# EAGLE design loochi-0.4 (EAGLE 6.2)
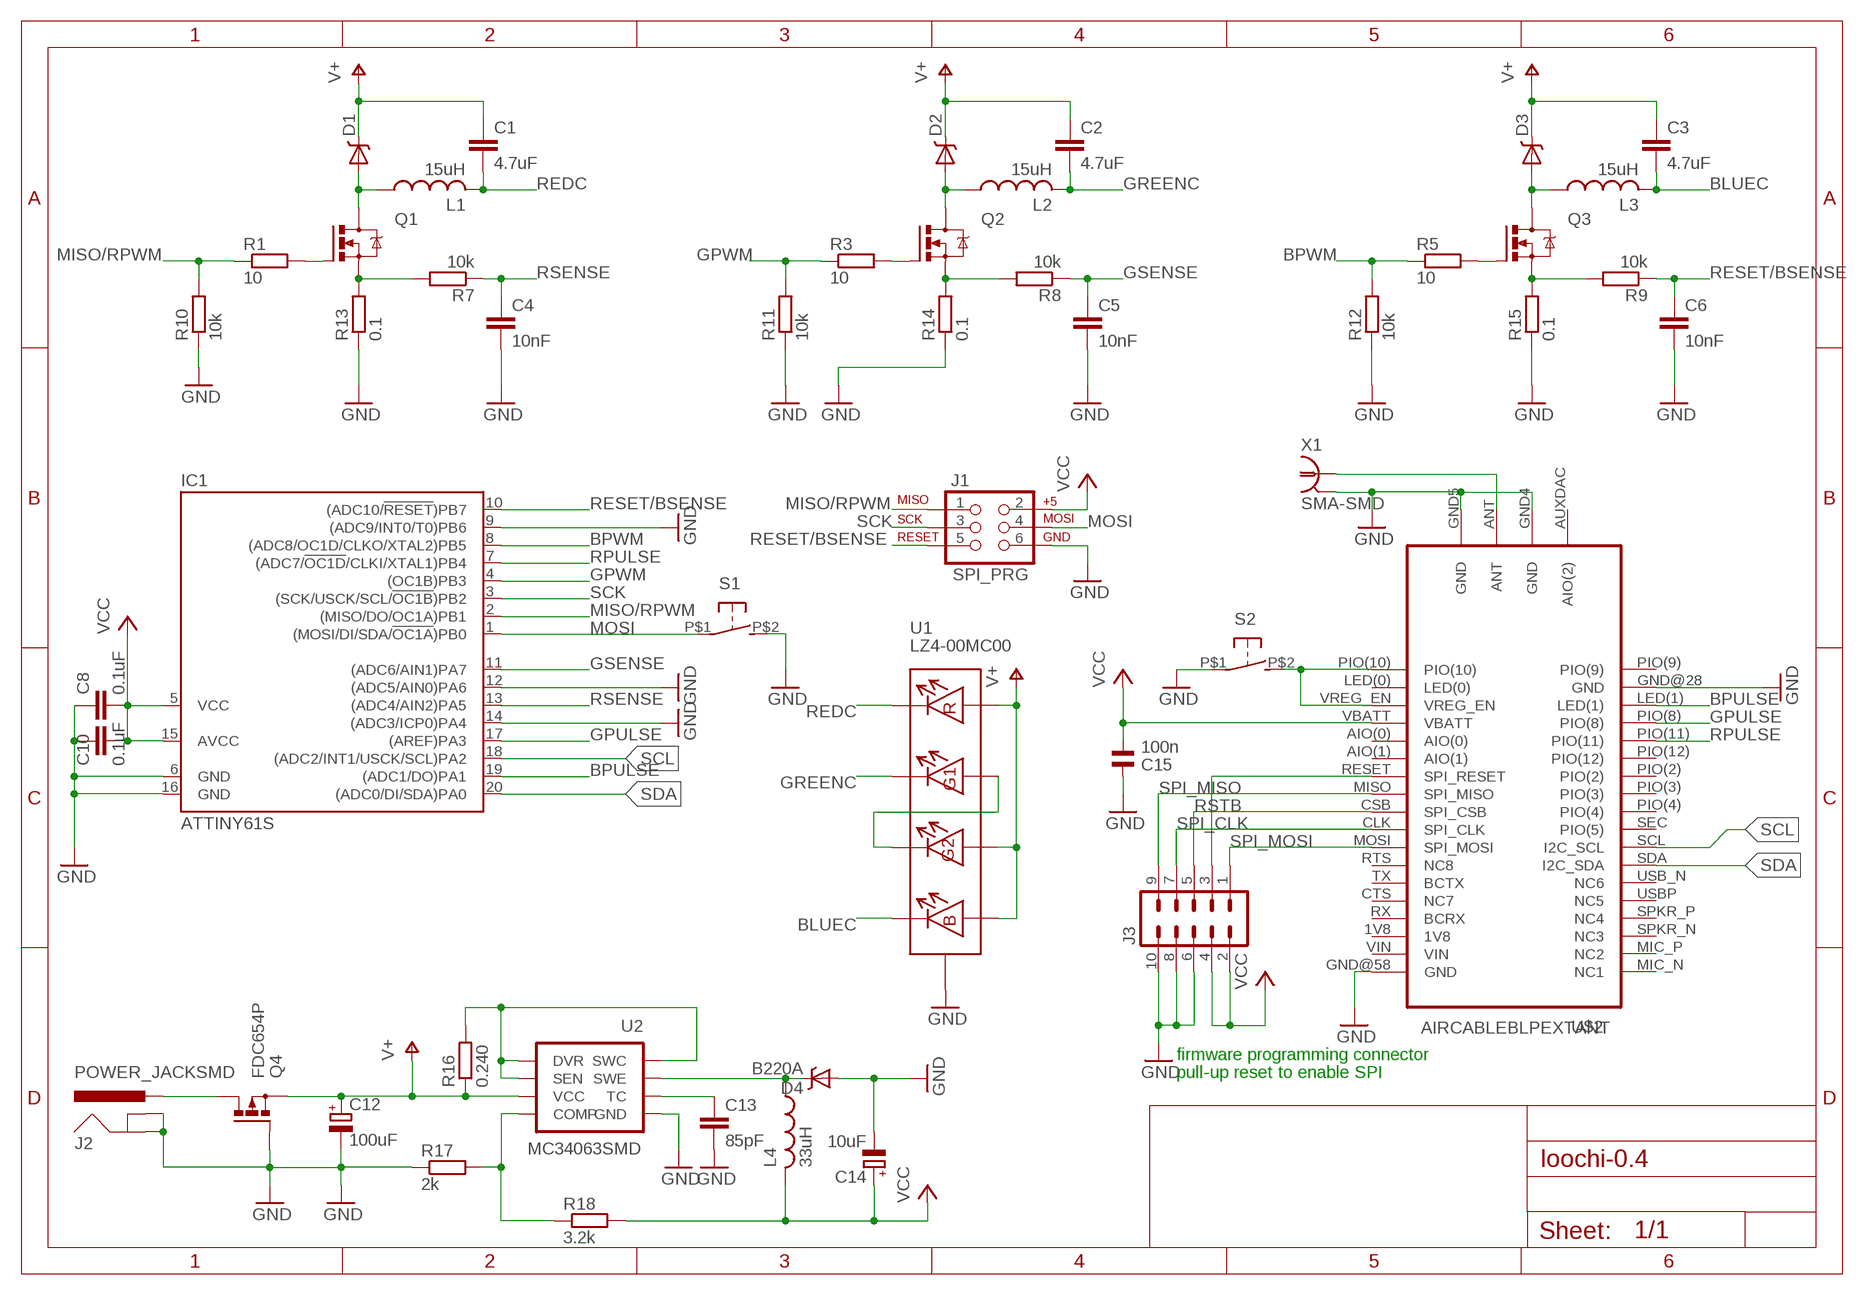
[diagram p0: schematic, sheet 1]

## Parts
C1  4.7uF  C-EUC0805  [C0805]
C2  4.7uF  C-EUC0805  [C0805]
C3  4.7uF  C-EUC0805  [C0805]
C4  10nF  C-EUC0805  [C0805]
C5  10nF  C-EUC0805  [C0805]
C6  10nF  C-EUC0805  [C0805]
C8  0.1uF  C-EUC0805  [C0805]
C10  0.1uF  C-EUC0805  [C0805]
C12  100uF  CPOL-EUD  [PANASONIC_D]
C13  85pF  C-EUC0805  [C0805]
C14  10uF  CPOL-EUUD-4X5,8  [UD-4X5,8_NICHICON]
C15  100n  C_0805  [C0805]
D1  PMEG4010CEH  DIODE-SCHOTTKY  [SOD123F]
D2  PMEG4010CEH  DIODE-SCHOTTKY  [SOD123F]
D3  PMEG4010CEH  DIODE-SCHOTTKY  [SOD123F]
D4  B220A  DIODE-SCHOTTKYBIGPAD  [SMA-DIODE-BIG]
IC1  ATTINY61S  [SO20L]
J1  SPI_PRG  AVR_SPI_PRG_6NS  [2X3-NS]
J2  POWER_JACKSMD  [POWER_JACK_SMD]
J3  MA05-2  [MA05-2]
L1  15uH  L-USBOURNS-6045  [BOURNS-6045]
L2  15uH  L-USBOURNS-6045  [BOURNS-6045]
L3  15uH  L-USBOURNS-6045  [BOURNS-6045]
L4  33uH  L-USBOURNS-6045  [BOURNS-6045]
Q1  PMN25ENSOT457  [SOT457]
Q2  PMN25ENSOT457  [SOT457]
Q3  PMN25ENSOT457  [SOT457]
Q4  FDC654P  [SUPERSOT6]
R1  10  R-EU_R0805  [R0805]
R3  10  R-EU_R0805  [R0805]
R5  10  R-EU_R0805  [R0805]
R7  10k  R-EU_R0805  [R0805]
R8  10k  R-EU_R0805  [R0805]
R9  10k  R-EU_R0805  [R0805]
R10  10k  R-EU_R0805  [R0805]
R11  10k  R-EU_R0805  [R0805]
R12  10k  R-EU_R0805  [R0805]
R13  0.1  R-EU_R0805  [R0805]
R14  0.1  R-EU_R0805  [R0805]
R15  0.1  R-EU_R0805  [R0805]
R16  0.240  R-EU_R0805  [R0805]
R17  2k  R-EU_R0805  [R0805]
R18  3.2k  R-EU_R0805  [R0805]
S1  ALPS-SKRK39X29  [ALPS-SKRK-39X29]
S2  ALPS-SKRK39X29  [ALPS-SKRK-39X29]
U1  LZ4-00MC00  [LZ4-00MC00]
U2  MC34063SMD  [SO08]
U$2  AIRCABLEBLPEXTANT  [AIRCABLEBLP]
X1  SMA-SMD  [SMA-SMD]

## Nets
BLUEC: C3.2 L3.P$2 U1.P$8
BPULSE: IC1.19((ADC1/DO)PA1) U$2.LED(1)
BPWM: IC1.8((ADC8/OC1D/CLKO/XTAL2)PB5) R5.1 R12.2
GND: C4.2 C5.2 C6.2 C8.1 C10.1 C12.- C13.2 C14.- C15.1 D4.A IC1.6(GND) IC1.9((ADC9/INT0/T0)PB6) IC1.12((ADC5/AIN0)PA6) IC1.14((ADC3/ICP0)PA4) IC1.16(GND) J1.6 J2.GND(GNDBREAK) J2.P$4(GND) J3.6 J3.8 J3.10 Q4.P$3(G) R10.1 R11.1 R12.1 R13.1 R14.1 R15.1 R17.1 S1.P$2(S) S2.P$1(P) U1.THERMAL U1.THERMAL-VIA2(THERMAL) U1.THERMAL-VIA(THERMAL) U2.4(GND) U$2.GND4(GND) U$2.GND5(GND) U$2.GND@28(GND) U$2.GND@58(GND) X1.2@1(GND)
GPULSE: IC1.17((AREF)PA3) U$2.PIO(8)
GPWM: IC1.4((OC1B)PB3) R3.1 R11.2
GREENC: C2.2 L2.P$2 U1.P$6
GSENSE: C5.1 IC1.11((ADC6/AIN1)PA7) R8.1
MISO/RPWM: IC1.2((MISO/DO/OC1A)PB1) J1.1 R1.1 R10.2
MOSI: IC1.1((MOSI/DI/SDA/!OC1A!)PB0) J1.4 S1.P$1(P)
N$1: U1.P$1 U1.P$5
N$2: U$2.ANT X1.1
N$3: Q3.P$3(G) R5.2
N$4: Q2.P$3(G) R3.2
N$5: Q1.P$3(G) R1.2
N$6: S2.P$2(S) U$2.PIO(10) U$2.VREG_EN
N$7: Q1.P$4(S) R7.2 R13.2
N$8: D1.P$A(A) L1.P$1 Q1.P$1(D) Q1.P$2(D) Q1.P$5(D) Q1.P$6(D)
N$10: J2.VIN0(PWR) J2.VIN1(PWR) Q4.P$1(D) Q4.P$2(D) Q4.P$5(D) Q4.P$6(D)
N$14: D2.P$A(A) L2.P$1 Q2.P$1(D) Q2.P$2(D) Q2.P$5(D) Q2.P$6(D)
N$15: J3.3 U$2.RESET(SPI_RESET)
N$16: R16.2 U2.1(SWC) U2.7(SEN) U2.8(DVR)
N$17: Q2.P$4(S) R8.2 R14.2
N$18: C13.1 U2.3(TC)
N$23: D3.P$A(A) L3.P$1 Q3.P$1(D) Q3.P$2(D) Q3.P$5(D) Q3.P$6(D)
N$24: D4.C L4.P$1 U2.2(SWE)
N$25: Q3.P$4(S) R9.2 R15.2
N$26: R17.2 R18.1 U2.5(COMP)
REDC: C1.2 L1.P$2 U1.P$4
RESET/BSENSE: C6.1 IC1.10((ADC10/!RESET!)PB7) J1.5 R9.1
RPULSE: IC1.7((ADC7/!OC1D!/CLKI/XTAL1)PB4) U$2.PIO(11)
RSENSE: C4.1 IC1.13((ADC4/AIN2)PA5) R7.1
RSTB: J3.5 U$2.CSB(SPI_CSB)
SCK: IC1.3((SCK/USCK/SCL/!OC1B!)PB2) J1.3
SCL: IC1.18((ADC2/INT1/USCK/SCL)PA2) U$2.SCL(I2C_SCL)
SDA: IC1.20((ADC0/DI/SDA)PA0) U$2.SDA(I2C_SDA)
SPI_CLK: J3.7 U$2.CLK(SPI_CLK)
SPI_MISO: J3.9 U$2.MISO(SPI_MISO)
SPI_MOSI: J3.1 U$2.MOSI(SPI_MOSI)
V+: C1.1 C2.1 C3.1 C12.+ D1.P$C(C) D2.P$C(C) D3.P$C(C) Q4.P$4(S) R16.1 U1.P$2 U1.P$3 U1.P$7 U2.6(VCC)
VCC: C8.2 C10.2 C14.+ C15.2 IC1.5(VCC) IC1.15(AVCC) J1.2 J3.2 J3.4 L4.P$2 R18.2 U$2.VBATT
Unconnected: U$2.1V8 U$2.AIO(0) U$2.AIO(1) U$2.AUXDAC(AIO(2)) U$2.CTS(NC7) U$2.LED(0) U$2.MIC_N(NC1) U$2.MIC_P(NC2) U$2.PIO(2) U$2.PIO(3) U$2.PIO(4) U$2.PIO(9) U$2.PIO(12) U$2.RTS(NC8) U$2.RX(BCRX) U$2.SEC(PIO(5)) U$2.SPKR_N(NC3) U$2.SPKR_P(NC4) U$2.TX(BCTX) U$2.USB_N(NC6) U$2.USBP(NC5) U$2.VIN

## Notes on the sheet
- firmware programming connector
- pull-up reset to enable SPI

## Power pins joined to a net without a drawn wire
GND: X1.2@2(GND) X1.2@3(GND) X1.2@4(GND) X1.2@5(GND) X1.2@6(GND)

## Library data of the parts
C1-C6 C8 C10 C13 = rcl:C-EU: CAPACITOR, European symbol
C12 C14 = rcl:CPOL-EU: POLARIZED CAPACITOR, European symbol
C15 = rc-master-smd:C_: NON-POLARIZED CAP; PARTNO: *
D1-D4 = diode-schottky:DIODE-SCHOTTKY
IC1 = attinyx61:ATTINY*61: AtTinyX61; MPN: ATTINY261-20SU; OC_FARNELL: 1455147; OC_NEWARK: 58M3783
J1 = SparkFun:AVR_SPI_PRG_6: AVR ISP 6 Pin This is the reduced ISP connector for AVR programming. Common on Arduino. This footprint will take up less PCB space and can be used with a 10-pin to 6-pin adapter such as SKU: BOB-08508
J2 = SparkFun:POWER_JACK: Power Jack This is the standard 5.5mm barrel jack for power. The PTH is the most common, proven, reliable, footprint. All others are experimental. The Slot footprint only works if the mill layer is transmitted to the PCB fab house so be warned. Spark Fun Electronics SKU : PRT-00119. Mating wall wart : TOL-00298 (and others)
J3 = con-lstb:MA05-2: PIN HEADER
L1-L4 = inductors:L-US: INDUCTOR, American symbol
Q1-Q3 = mosfet:PMN25EN: N-CHANNEL MOS FET
Q4 = mosfet:FDC654P: FDC654P
R1 R3 R5 R7-R18 = rcl:R-EU_: RESISTOR, European symbol
S1 S2 = buttons:ALPS-SKRK: OMRON SWITCH
U1 = ledengin:LZ4-00MC00
U2 = SparkFun:MC34063
U$2 = aircable:AIRCABLEBLP
X1 = con-coax:SMA-SMD: SMA 50 Ohm Straight Jack Receptacle - Surface Mount www.johnsoncomponents.com Source: http://catalog.digikey.com .. 142-0711-201, 205, 202, 206.pdf; OC_FARNELL: unknown; OC_NEWARK: unknown

## Board
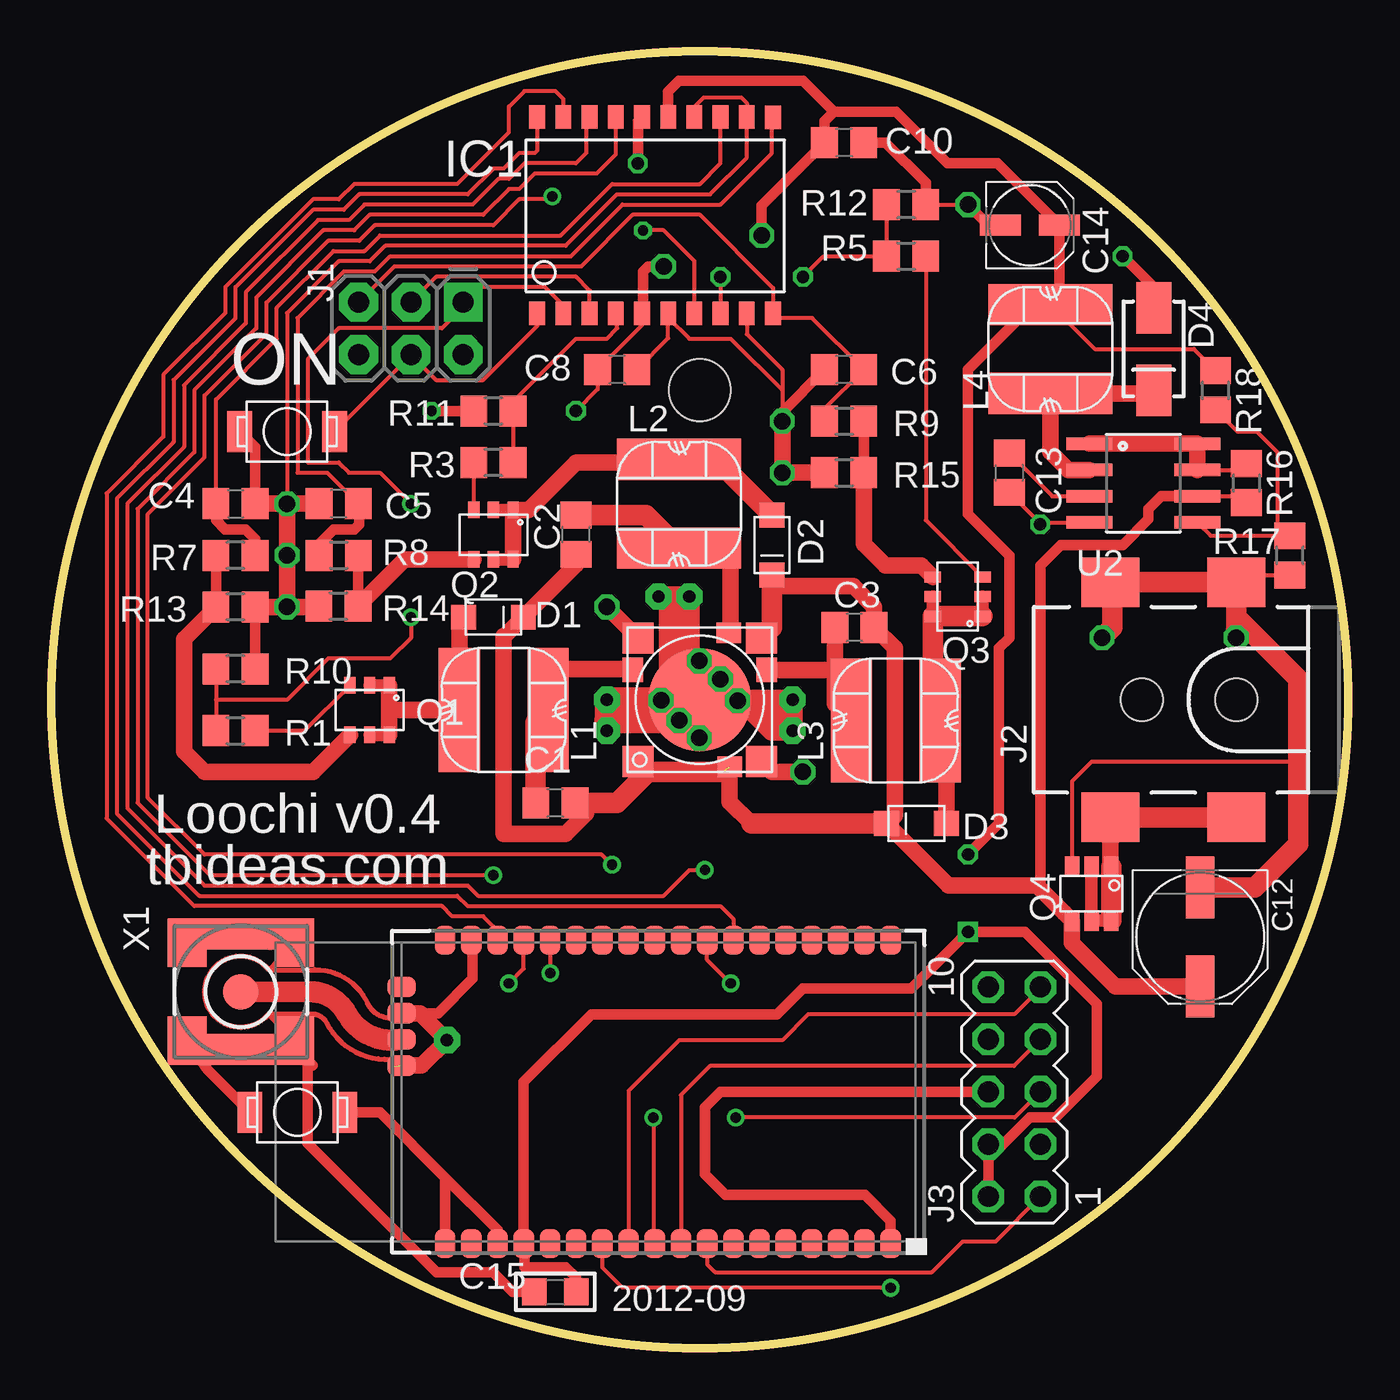
[diagram p1: board, top side]
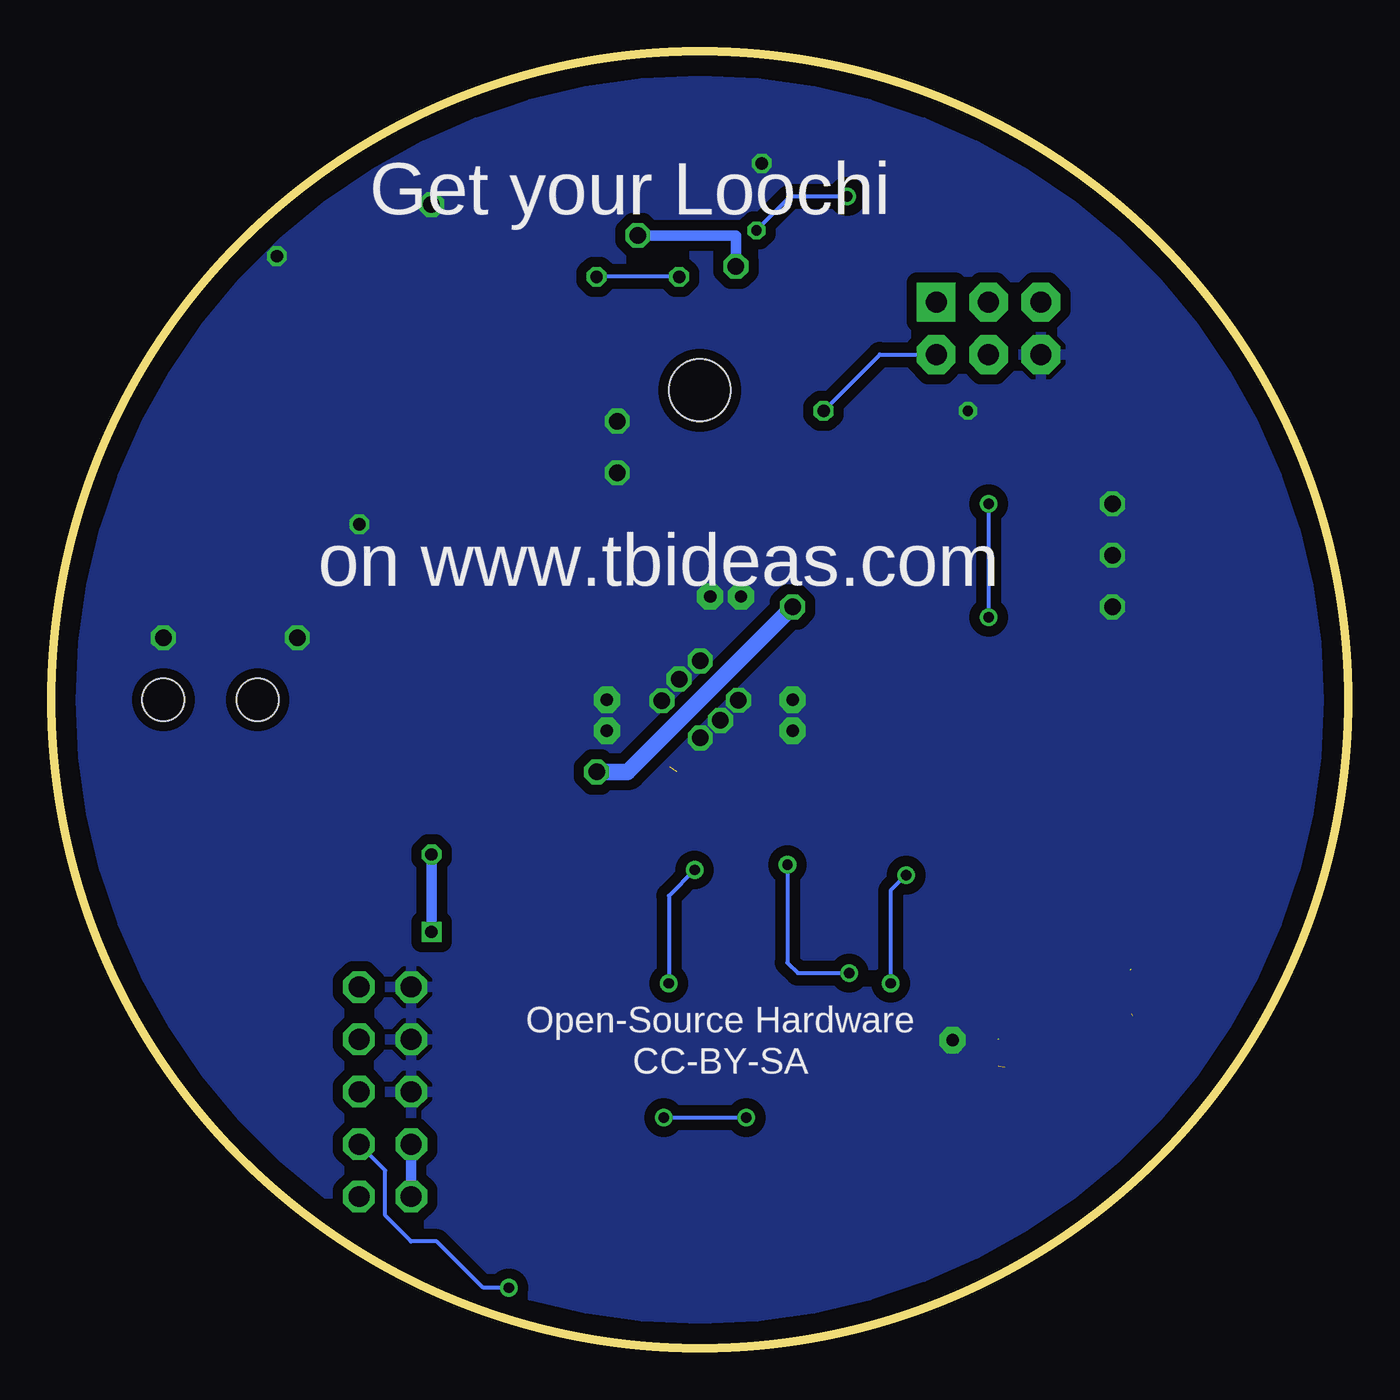
[diagram p2: board, bottom side, seen from below]

Size 62.83 x 62.83 mm. Coordinates in mm from the lower left corner, seen from the top.
Outline: circle at 31.42,31.42 radius 31.42
Copper layers (1*16): Top 0.0356mm / dielectric 1.5011mm / Bottom 0.0356mm
Design rules: minimum track width 6mil, minimum drill 13mil, track to track 6mil, track to pad 6mil, pad to pad 6mil, via to via 6mil, smd to smd 6mil, copper to edge 15mil, drill to drill 6mil, minimum pad ring 7mil, minimum via ring 7mil, stop-mask expansion 4mil, vias tented up to drill 0mil, thermal gap 10mil
Holes 3 mm at 31.42,46.42

### Footprints (pad centres in the part's own frame; a part is rotated, then mirrored left to right if it is on the bottom)
C0805 = smd 1.3 x 1.5: 1 -0.95,0; 2 0.95,0
PANASONIC_D = smd 3 x 1.4: + 2.4,0; - -2.4,0
UD-4X5,8_NICHICON = smd 2 x 1: + 1.425,0; - -1.425,0
C0805' = smd 1.2 x 1.3: 1 -1.016,0; 2 1.016,0
SOD123F = smd 1.2 x 1.2: P$A -1.45,0; P$C 1.45,0
SMA-DIODE-BIG = smd 2.5 x 1.7: A -2,0; C 2,0
SO20L = smd 0.762 x 1.143: 1 -5.08,-5.131; 2 -3.81,-5.131; 3 -2.54,-5.131; 4 -1.27,-5.131; 5 0,-5.131; 6 1.27,-5.131; 7 2.54,-5.131; 8 3.81,-5.131; 9 5.08,-5.131; 10 6.35,-5.131; 11 6.35,4.369; 12 5.08,4.394; 13 3.81,4.394; 14 2.54,4.394; 15 1.27,4.394; 16 0,4.394; 17 -1.27,4.394; 18 -2.54,4.394; 19 -3.81,4.394; 20 -5.08,4.394
2X3-NS = drill 1.016 pad 1.88 square: 1 -2.54,-1.27 | drill 1.016 pad 1.88 octagon: 2 -2.54,1.27; 3 0,-1.27; 4 0,1.27; 5 2.54,-1.27; 6 2.54,1.27
POWER_JACK_SMD = smd 2.8 x 2.4: GND 0,-5.7; P$4 6.1,-5.7; VIN0 0,5.7; VIN1 6.1,5.7 | hole 2.032: 0,0; 4.572,0
MA05-2 = drill 1.016 octagon: 1 -5.08,-1.27; 2 -5.08,1.27; 3 -2.54,-1.27; 4 -2.54,1.27; 5 0,-1.27; 6 0,1.27; 7 2.54,-1.27; 8 2.54,1.27; 9 5.08,-1.27; 10 5.08,1.27
BOURNS-6045 = smd 2 x 6: P$1 -2.15,0; P$2 2.15,0
SOT457 = smd 0.8 x 0.55: P$1 -1.2,0.95; P$2 -1.2,0; P$3 -1.2,-0.95; P$4 1.2,-0.95; P$5 1.2,0; P$6 1.2,0.95
SUPERSOT6 = smd 0.7 x 1: P$1 -0.95,-1.3; P$2 0,-1.3; P$3 0.95,-1.3; P$4 0.95,1.3; P$5 0,1.3; P$6 -0.95,1.3
R0805 = smd 1.3 x 1.5: 1 -0.95,0; 2 0.95,0
ALPS-SKRK-39X29 = smd 1.2 x 2: P$1 -2.3,0; P$2 2.3,0
LZ4-00MC00 = smd 1.5 x 1.5: P$1 -3,3; P$3 3,3; P$5 3,-3; P$7 -3,-3 | smd 1.2 x 1: P$2 -1.45,3.25; P$6 -1.4,-3.25 | smd 1 x 1.2: P$4 3.25,-1.45; P$8 -3.25,-1.45 | smd 5 x 5: THERMAL 0,0 | drill 0.8 octagon: THERMAL-VIA -1,-1; THERMAL-VIA2 1,1
SO08 = smd 0.61 x 2.21: 1 -1.905,-2.616; 2 -0.635,-2.616; 3 0.635,-2.616; 4 1.905,-2.616; 5 1.905,2.616; 6 0.635,2.616; 7 -0.635,2.616; 8 -1.905,2.616
AIRCABLEBLP = smd 1 x 1.4: 1V8 -8.71,7.35; AIO(0) 5.26,7.35; AIO(1) 3.99,7.35; CLK -1.09,7.35; CSB 0.18,7.35; CTS -3.63,7.35; GND@28 9.07,-7.35; GND@58 -11.25,7.35; LED(0) 9.07,7.35; LED(1) 7.8,-7.35; MIC_N -9.98,-7.35; MIC_P -11.25,-7.35; MISO 1.45,7.35; MOSI -2.36,7.35; PIO(2) 2.72,-7.35; PIO(3) 1.45,-7.35; PIO(4) 0.18,-7.35; PIO(8) 6.53,-7.35; PIO(9) 10.34,-7.35; PIO(10) 10.34,7.35; PIO(11) 5.26,-7.35; PIO(12) 3.99,-7.35; RESET 2.72,7.35; RTS -6.17,7.35; RX -7.44,7.35; SCL -2.36,-7.35; SDA -3.63,-7.35; SEC -1.09,-7.35; SPKR_N -7.44,-7.35; SPKR_P -8.71,-7.35; TX -4.9,7.35; USB_N -4.9,-7.35; USBP -6.17,-7.35; VBATT 6.53,7.35; VIN -9.98,7.35; VREG_EN 7.8,7.35 | smd 1.4 x 1: ANT 12.45,-2.54; AUXDAC 12.45,-5.08; GND4 12.45,-1.27; GND5 12.45,-3.81
SMA-SMD = smd 1.73 x 1.73: 1 0,0 | smd 2.35 x 1.9: 2@1 -2.375,2.6; 2@2 -2.375,-2.6; 2@3 2.375,-2.6; 2@4 2.375,2.6 | smd 1.5 x 3.4: 2@5 -2.8,0; 2@6 2.8,0

### Placement (x,y rotation side)
C1  24.42,26.42 180 top
C2  25.42,39.42 90 top
C3  38.92,34.92 180 top
C4  8.92,40.92 0 top
C5  13.92,40.92 180 top
C6  38.42,47.42 180 top
C8  27.42,47.42 180 top
C10  38.42,58.42 180 top
C12  55.67,19.92 270 top
C13  46.42,42.42 270 top
C14  47.42,54.42 0 top
C15  100n  [C0805']  24.42,2.72 0 top
D1  21.42,35.42 0 top
D2  34.92,38.92 270 top
D3  41.92,25.42 180 top
D4  53.42,48.42 270 top
IC1  28.62,55.27 0 top
J1  17.42,49.42 180 top
J2  57.42,31.42 180 top
J3  46.67,12.42 90 top
L1  21.92,30.92 0 top
L2  30.42,40.92 270 top
L3  40.92,30.42 180 top
L4  48.42,48.42 90 top
Q1  15.42,30.92 270 top
Q2  21.42,39.42 270 top
Q3  43.92,36.42 180 top
Q4  50.41,22.02 180 top
R1  8.92,29.92 0 top
R3  21.42,42.92 180 top
R5  41.42,52.92 0 top
R7  8.92,38.42 180 top
R8  13.92,38.42 0 top
R9  38.42,44.92 0 top
R10  8.92,32.92 180 top
R11  21.42,45.42 0 top
R12  41.42,55.42 180 top
R13  8.92,35.92 180 top
R14  13.91,35.96 0 top
R15  38.42,42.42 0 top
R16  57.92,41.92 90 top
R17  60.02,38.42 90 top
R18  56.42,46.42 90 top
S1  11.42,44.42 180 top
S2  11.92,11.42 0 top
U1  31.42,31.42 180 top
U2  52.92,41.92 270 top
U$2  29.42,12.42 180 top
X1  9.18,17.27 90 top

### Tracks (layer width: path | path; a pad name or v marks a point on that pad's centre or on a via)
BLUEC
  Top 0.8: C3.2 37.97,32.92 | 37.97,32.92 37.97,31.22 L3.P$2 | U1.P$8 37.92,32.87 37.97,32.92
  Top 1: 38.77,32.92 L3.P$2 38.42,30.77 38.42,30.92 38.97,31.47
BPULSE
  Top 0.2: IC1.19 24.81,60.53 24.42,60.92 22.92,60.92 22.17,60.17 22.17,58.92 19.67,56.42 14.67,56.42 13.92,55.67 12.67,55.67 8.42,51.42 8.42,50.17 5.42,47.17 5.42,44.17 2.67,41.42 2.67,25.67 6.92,21.42 18.92,21.42 19.42,20.92 20.92,20.92 21.62,20.22 U$2.LED(1)
BPWM  (via drill 0.6)
  Top 0.2: R12.2 R5.1 37.42,52.92 v36.42,51.92 | v32.42,51.92 IC1.8
  Bottom 0.2: v32.42,51.92 v36.42,51.92
GND  (via drill 0.5, 0.6, 0.6 pad 1.27, 0.8)  (3 unrouted)
  Top 0.2: C13.2 47.87,40.01 | 47.87,40.01 U2.4 | 33.42,59.94 IC1.12 | 31.12,59.7 IC1.14 31.16,60.16 31.62,60.62 33.42,60.62 33.7,60.34 IC1.12 | IC1.12 33.7,57.7 31.92,55.92 27.42,55.92 24.92,53.42 16.17,53.42 15.42,52.67 13.92,52.67 11.42,50.17 v11.42,40.92 | R12.1 v44.42,55.42 | 47.87,40.01 47.92,39.97 v47.92,39.92 | J2.GND 57.77,37.47 R17.1 | 60.42,28.42 50.42,28.42 49.46,27.46 Q4.P$3 | IC1.9 33.7,49.14 35.42,47.42 v35.42,44.92 35.42,46.42 32.92,48.92 30.92,48.92 29.89,49.95 IC1.6 29.89,48.94 C8.1
  Top 0.254: X1.2@3 10.56,18.31 12.52,18.31 arc-72 15.32,16.69 arc69 16.54,16 | X1.2@2 10.5,16.18 12.47,16.18 arc-71 13.33,15.75 arc66 16.41,14 16.64,13.61 | 10.44,16.1 arc-278 10.49,18.36
  Top 0.5: IC1.16 28.42,59.46 v28.42,57.42 | C14.- 45.42,54.42 v44.42,55.42 | v51.92,52.92 53.42,51.42 D4.A | R12.1 42.37,56.47 40.42,58.42 C10.1 | 12.42,13.92 12.42,9.92 18.67,3.67 21.4,3.67 22.35,2.72 C15.1 | 12.42,13.92 12.42,14.29 12.34,14.37 | X1.2@3 10.59,19.54 X1.2@6 7.99,19.97 X1.2@4 | 12.34,14.37 X1.2@5 9.74,14.79 X1.2@1 7.57,13.47 S2.P$1 | 12.34,14.37 X1.2@2 | 12.65,13.69 12.42,13.92 | U$2.GND@28 20.42,19.7 20.42,17.92 18.73,16.23 17.86,16.23 | S1.P$2 9.87,43.67 C4.2 | R13.1 R10.1 | C6.2 35.42,45.37 v35.42,44.92 | R11.1 v18.42,45.42 | 16.95,13.67 U$2.GND4 | J3.6 32.42,12.42 31.67,11.67 31.67,8.42 32.67,7.42 39.42,7.42 40.67,6.17 U$2.GND@58
  Top 0.8: U$2.GND5 17.86,16.23 v19.17,14.92 17.94,13.69 U$2.GND4 | R13.1 v11.42,35.92 | v11.42,35.92 12.92,35.92 R14.1 | C4.2 v11.42,40.92 | v11.42,40.92 v11.42,35.92 | v11.42,40.92 C5.2 | R15.1 v35.42,42.42 v35.42,44.92
  Top 1: 30.92,31.42 U1.THERMAL 34.42,31.42 | 34.42,31.42 v35.92,31.42 v35.92,29.92 | 34.42,31.42 v35.92,29.92 | v35.92,29.92 34.92,29.92 33.92,30.92 | v29.42,36.42 29.92,36.42 | 29.92,36.42 v30.92,36.42 30.92,31.42 | 30.92,31.42 29.92,32.42 29.92,36.42 | J2.P$4 J2.GND 57.42,35.42 | 57.42,35.42 v57.42,34.42 | v50.92,34.42 51.42,34.92 51.42,36.92 | 57.42,35.42 60.42,32.42 60.42,28.42 60.42,24.42 58.32,22.32 C12.-
  Top 1.2: 26.92,30.42 v26.92,31.42 29.42,31.42 U1.THERMAL-VIA2 26.92,30.42 | v26.92,29.92 26.92,30.42
  other vias: 11.42,38.42 29.54,31.39 31.39,29.57 33.25,31.37 31.39,33.3
  pour Bottom (isolate 0.5, rank 2): 31.42,61.42 arc-90 61.42,31.42 arc-90 31.42,1.42 arc-90 1.42,31.42 arc-90
GPULSE  (via drill 0.5)
  Top 0.2: IC1.17 27.35,57.85 26.42,56.92 23.42,56.92 22.67,56.17 22.17,56.17 20.92,54.92 15.42,54.92 14.67,54.17 13.17,54.17 9.92,50.92 9.92,49.42 6.92,46.42 6.92,43.42 4.17,40.67 4.17,26.42 7.67,22.92 v21.42,22.92 | 22.67,19.99 U$2.PIO(8) 22.89,18.39 v22.17,17.67
  Bottom 0.2: v22.17,17.67 22.17,22.17 v21.42,22.92
GPWM
  Top 0.2: R3.1 R11.2 22.37,45.87 25.42,48.92 26.92,48.92 27.42,49.42 27.42,50.06 IC1.4
GREENC
  Top 0.8: 32.92,38.62 32.92,38.92 | 32.92,38.62 30.57,38.62 L2.P$2 | 32.92,38.62 32.92,34.77 U1.P$6
  Top 1: C2.2 28.82,40.37 L2.P$2
GSENSE
  Top 0.2: IC1.11 34.92,59.58 34.92,57.92 32.42,55.42 27.67,55.42 25.17,52.92 16.42,52.92 15.67,52.17 14.17,52.17 11.92,49.92 11.92,42.42 13.37,42.42 C5.1
  Top 0.5: C5.1 14.92,40.87 14.92,39.92 14.67,39.67 13.67,39.67 12.97,38.97 R8.1
MISO/RPWM  (via drill 0.5)
  Top 0.2: R10.2 7.97,31.42 | 7.97,31.42 R1.1 | IC1.2 24.81,50.53 23.92,51.42 20.69,51.42 J1.1 19.96,50.46 18.92,49.42 13.92,49.42 12.42,47.92 12.42,42.92 13.92,42.92 14.42,42.42 15.92,42.42 v17.42,40.92 | v17.42,35.42 17.42,34.42 16.42,33.42 13.42,33.42 11.42,31.42 7.97,31.42
  Bottom 0.2: v17.42,40.92 v17.42,35.42
MOSI
  Top 0.2: S1.P$1 17.42,48.12 J1.4 18.65,46.92 20.92,46.92 23.54,49.54 IC1.1
N$1  (via drill 0.8)
  Top 0.8: U1.P$5 v26.92,35.92 | U1.P$1 34.92,27.92 v36.42,27.92
  Bottom 0.8: v26.92,35.92 34.92,27.92 v36.42,27.92
N$2  (1 unrouted)
  Top 1.016: X1.1 12.52,17.27 arc-61 14.3,16.2 arc71 16.92,14.96
N$3
  Top 0.2: R5.2 42.37,40.12 Q3.P$3
N$4
  Top 0.2: R3.2 Q2.P$3
N$5
  Top 0.2: R1.2 12.27,29.92 Q1.P$3
N$6
  Top 0.5: S2.P$2 15.92,11.42 19.08,8.26 | 19.08,8.26 U$2.PIO(10) | U$2.VREG_EN 21.62,5.72 19.08,8.26
N$7
  Top 0.5: R13.2 R7.2
  Top 0.8: Q1.P$4 12.67,27.92 7.42,27.92 6.42,28.92 6.42,34.37 R13.2
N$8
  Top 0.6: Q1.P$1 Q1.P$2 | Q1.P$6 Q1.P$5
  Top 0.8: D1.P$A 19.77,35.22 L1.P$1 16.37,30.92 | 16.37,30.92 16.37,31.42 Q1.P$1 | Q1.P$6 16.37,30.92
N$10
  Top 0.6: Q4.P$2 Q4.P$5 Q4.P$6
  Top 0.8: 51.32,24.78 51.32,22.71 51.36,22.67
  Top 1: J2.VIN0 J2.VIN1 51.32,24.78 | Q4.P$1 51.36,22.67 Q4.P$6
N$14
  Top 0.6: Q2.P$5 Q2.P$6 | Q2.P$2 Q2.P$1
  Top 0.8: Q2.P$6 Q2.P$1 23.12,40.62 25.42,42.92 30.27,42.92 L2.P$1
  Top 1: L2.P$1 32.22,43.07 D2.P$A
N$15  (via drill 0.5)
  Top 0.2: v40.67,2.92 27.67,2.92 26.7,3.89 U$2.RESET
  Bottom 0.2: v40.67,2.92 41.92,2.92 44.17,5.17 45.42,5.17 46.67,6.42 46.67,8.61 J3.3
N$16
  Top 0.2: U2.7 57.6,42.55 R16.2
  Top 0.8: U2.1 U2.8 U2.7
N$17
  Top 0.5: R14.2 R8.2
  Top 0.8: R8.2 | Q2.P$4 17.12,38.22 R14.2
N$18
  Top 0.2: C13.1 48.5,41.28 U2.3
N$23
  Top 0.6: Q3.P$5 Q3.P$6 | Q3.P$2 Q3.P$1
  Top 0.8: L3.P$1 42.87,30.22 43.37,29.72 D3.P$A
  Top 1: L3.P$1 42.72,30.77 Q3.P$6 Q3.P$1
N$24
  Top 0.8: D4.C 53.27,46.27 L4.P$1 48.42,43.42 49.28,42.55 U2.2
N$25
  Top 0.5: R15.2 R9.2
  Top 0.8: Q3.P$4 42.17,37.92 40.42,37.92 39.37,38.97 R15.2
N$26
  Top 0.2: U2.5 56.18,39.37 R17.2 59.42,39.97 59.42,43.42 58.42,44.42 57.47,44.42 R18.1
REDC
  Top 0.8: U1.P$4 28.12,32.92 24.42,32.92 24.07,32.57 L1.P$2
  Top 1: L1.P$2 23.47,30.32 C1.2
RESET/BSENSE
  Top 0.2: J1.5 16.61,52.42 25.67,52.42 28.17,54.92 31.42,54.92 34.97,51.37 IC1.10 35.18,49.92 36.87,49.92 C6.1 37.47,45.52 R9.1
  Top 0.5: 34.92,50.08 IC1.10
RPULSE  (via drill 0.5)
  Top 0.2: IC1.7 31.16,52.68 29.67,54.17 v28.67,54.17 | v24.27,55.82 24.27,55.67 22.67,55.67 21.42,54.42 15.67,54.42 14.92,53.67 13.42,53.67 10.42,50.67 10.42,49.17 7.42,46.17 7.42,43.17 4.67,40.42 4.67,26.67 7.42,23.92 26.67,23.92 v27.17,23.42 | U$2.PIO(11) v24.17,18.17
  Bottom 0.2: v28.67,54.17 27.02,55.82 v24.27,55.82 | v27.17,23.42 27.17,18.67 26.67,18.17 v24.17,18.17
RSENSE
  Top 0.2: IC1.13 32.42,57.42 31.42,56.42 27.17,56.42 24.67,53.92 15.92,53.92 15.17,53.17 13.67,53.17 10.92,50.42 10.92,48.92 7.97,45.97 C4.1
  Top 0.5: C4.1 7.97,40.12 8.42,39.67 9.42,39.67 9.87,39.22 R7.1
RSTB  (via drill 0.5)
  Top 0.2: J3.5 46.69,11.17 v33.17,11.17 | v29.17,11.17 29.17,5.14 U$2.CSB
  Bottom 0.2: v33.17,11.17 v29.17,11.17
SCK
  Top 0.2: IC1.3 26.08,51.26 25.42,51.92 18.65,51.92 J1.3
SCL  (via drill 0.5)
  Top 0.2: IC1.18 25.92,59.5 25.92,57.92 25.42,57.42 22.92,57.42 22.17,56.67 21.67,56.67 20.42,55.42 15.17,55.42 14.42,54.67 12.92,54.67 9.42,51.17 9.42,49.67 6.42,46.67 6.42,43.67 3.67,40.92 3.67,26.17 7.42,22.42 20.17,22.42 20.67,21.92 29.67,21.92 30.92,23.17 v31.67,23.17 | v32.92,17.67 31.78,18.81 U$2.SCL
  Bottom 0.2: v31.67,23.17 32.92,21.92 v32.92,17.67
SDA
  Top 0.2: IC1.20 23.54,58.04 23.42,57.92 22.67,57.92 21.92,57.17 21.42,57.17 20.17,55.92 14.92,55.92 14.17,55.17 12.67,55.17 8.92,51.42 8.92,49.92 5.92,46.92 5.92,43.92 3.17,41.17 3.17,25.92 7.17,21.92 19.67,21.92 20.17,21.42 32.42,21.42 33.05,20.79 U$2.SDA
SPI_CLK
  Top 0.2: J3.7 46.65,13.67 31.92,13.67 30.51,12.26 U$2.CLK
SPI_MISO
  Top 0.2: J3.9 47.94,17.44 46.67,16.17 36.67,16.17 35.42,14.92 30.42,14.92 27.97,12.47 U$2.MISO
SPI_MOSI
  Top 0.2: U$2.MOSI 31.78,4.06 32.17,3.67 42.67,3.67 44.17,5.17 45.77,5.17 J3.1
V+  (1 unrouted)
  Top 0.2: U2.6 57.6,41.28 R16.1
  Top 0.5: U2.6 53.78,41.28 53.17,40.67 53.17,40.17 51.92,38.92 48.92,38.92 47.92,37.92 47.92,22.26 49.09,21.09
  Top 0.8: 38.92,25.42 D3.P$C | 34.92,36.92 38.87,36.92 39.87,35.92 C3.1 40.87,33.92 40.87,25.82 D3.P$C | C2.1 25.42,37.97 D1.P$C 21.97,34.52 21.92,34.52 21.92,24.92 24.92,24.92 25.92,25.92 25.92,26.42 | 33.92,25.42 32.87,26.47 U1.P$2 | D3.P$C 43.47,22.42 47.76,22.42 49.09,21.09 Q4.P$4 49.46,19.63 51.57,17.52 C12.+
  Top 1: 32.52,27.92 28.92,27.92 | 28.92,27.92 28.42,27.92 U1.P$3 | 33.92,25.42 D3.P$C | D2.P$C 34.92,36.92 34.92,34.92 U1.P$7 | C1.1 25.92,26.42 27.42,26.42 28.92,27.92
VCC  (via drill 0.6, 0.8)
  Top 0.2: L4.P$2 50.57,48.42 55.37,48.42 R18.2 | IC1.5 28.62,49.57 C8.2 26.47,46.47 v25.42,45.42
  Top 0.5: v44.42,23.92 45.92,25.42 45.92,33.92 46.42,34.42 46.42,38.42 44.42,40.42 44.42,47.42 47.57,50.57 L4.P$2 48.84,50.99 C14.+ 45.84,57.42 43.42,57.42 40.92,59.92 37.92,59.92 | IC1.15 29.89,60.89 30.42,61.42 36.42,61.42 37.92,59.92 | v34.42,53.92 34.42,55.37 C10.2 37.47,59.47 37.92,59.92 | IC1.5 28.67,50.18 28.67,52.17 28.92,52.42 v29.67,52.42 | J3.4 45.42,9.86 45.42,9.17 | 45.42,7.17 45.42,9.17 | 45.42,9.17 47.42,11.17 48.67,11.17 50.67,13.17 50.67,16.67 47.17,20.17 v44.42,20.17 41.67,17.42 36.42,17.42 35.17,16.17 26.17,16.17 22.89,12.89 U$2.VBATT 22.92,5.04 22.92,3.92 24.92,3.92 25.42,3.42 25.42,2.73 C15.2
  Bottom 0.2: v25.42,45.42 22.69,48.15 J1.2
  Bottom 0.5: v34.42,53.92 29.67,53.92 v29.67,52.42 | v44.42,23.92 v44.42,20.17 | J3.2 J3.4

### Text on the board
_tsilk: ON | Loochi v0.4 | tbideas.com | 2012-09
_bsilk: Get your Loochi | on www.tbideas.com | Open-Source Hardware | CC-BY-SA